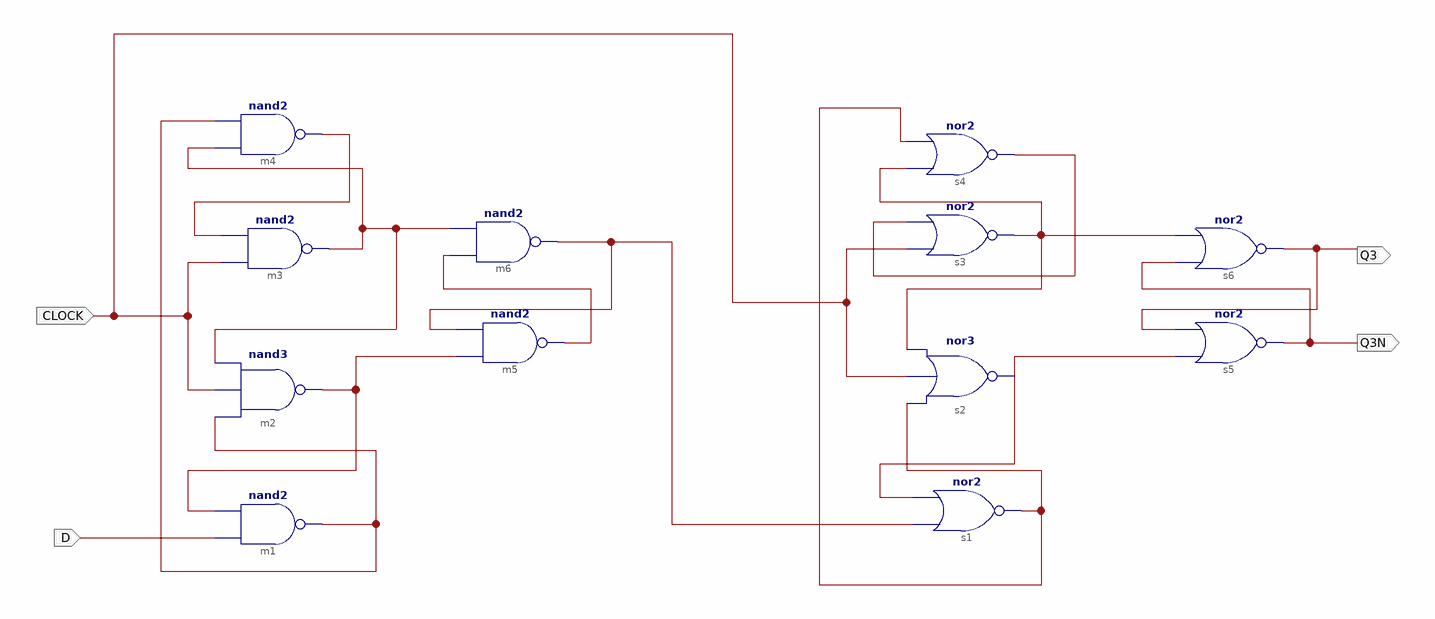
[diagram p0: schematic sheet 1]
// Xilinx ISE schematic MazzeoMS.sch (spartan3e) as structural Verilog: 12 symbols, 4 ports
module MazzeoMS (
  input  CLOCK,
  input  D,
  output Q3,
  output Q3N
);

  wire M, W, W1, X, X1, XLXN_86, Y, Y1, Z, Z1;

  nor s4 (Y1, W1, X1);
  nor s3 (W1, CLOCK, Y1);
  nor s6 (Q3, Q3N, W1);
  nor s5 (Q3N, Z1, Q3);
  nor s1 (X1, M, Z1);
  nand m4 (Y, W, X);
  nand m3 (W, CLOCK, Y);
  nand m1 (X, D, Z);
  nand m2 (Z, X, CLOCK, W);
  nor s2 (Z1, X1, CLOCK, W1);
  nand m6 (M, XLXN_86, W);
  nand m5 (XLXN_86, Z, M);
endmodule
